# EAGLE design Blumen_Frente (EAGLE 9.6.2)
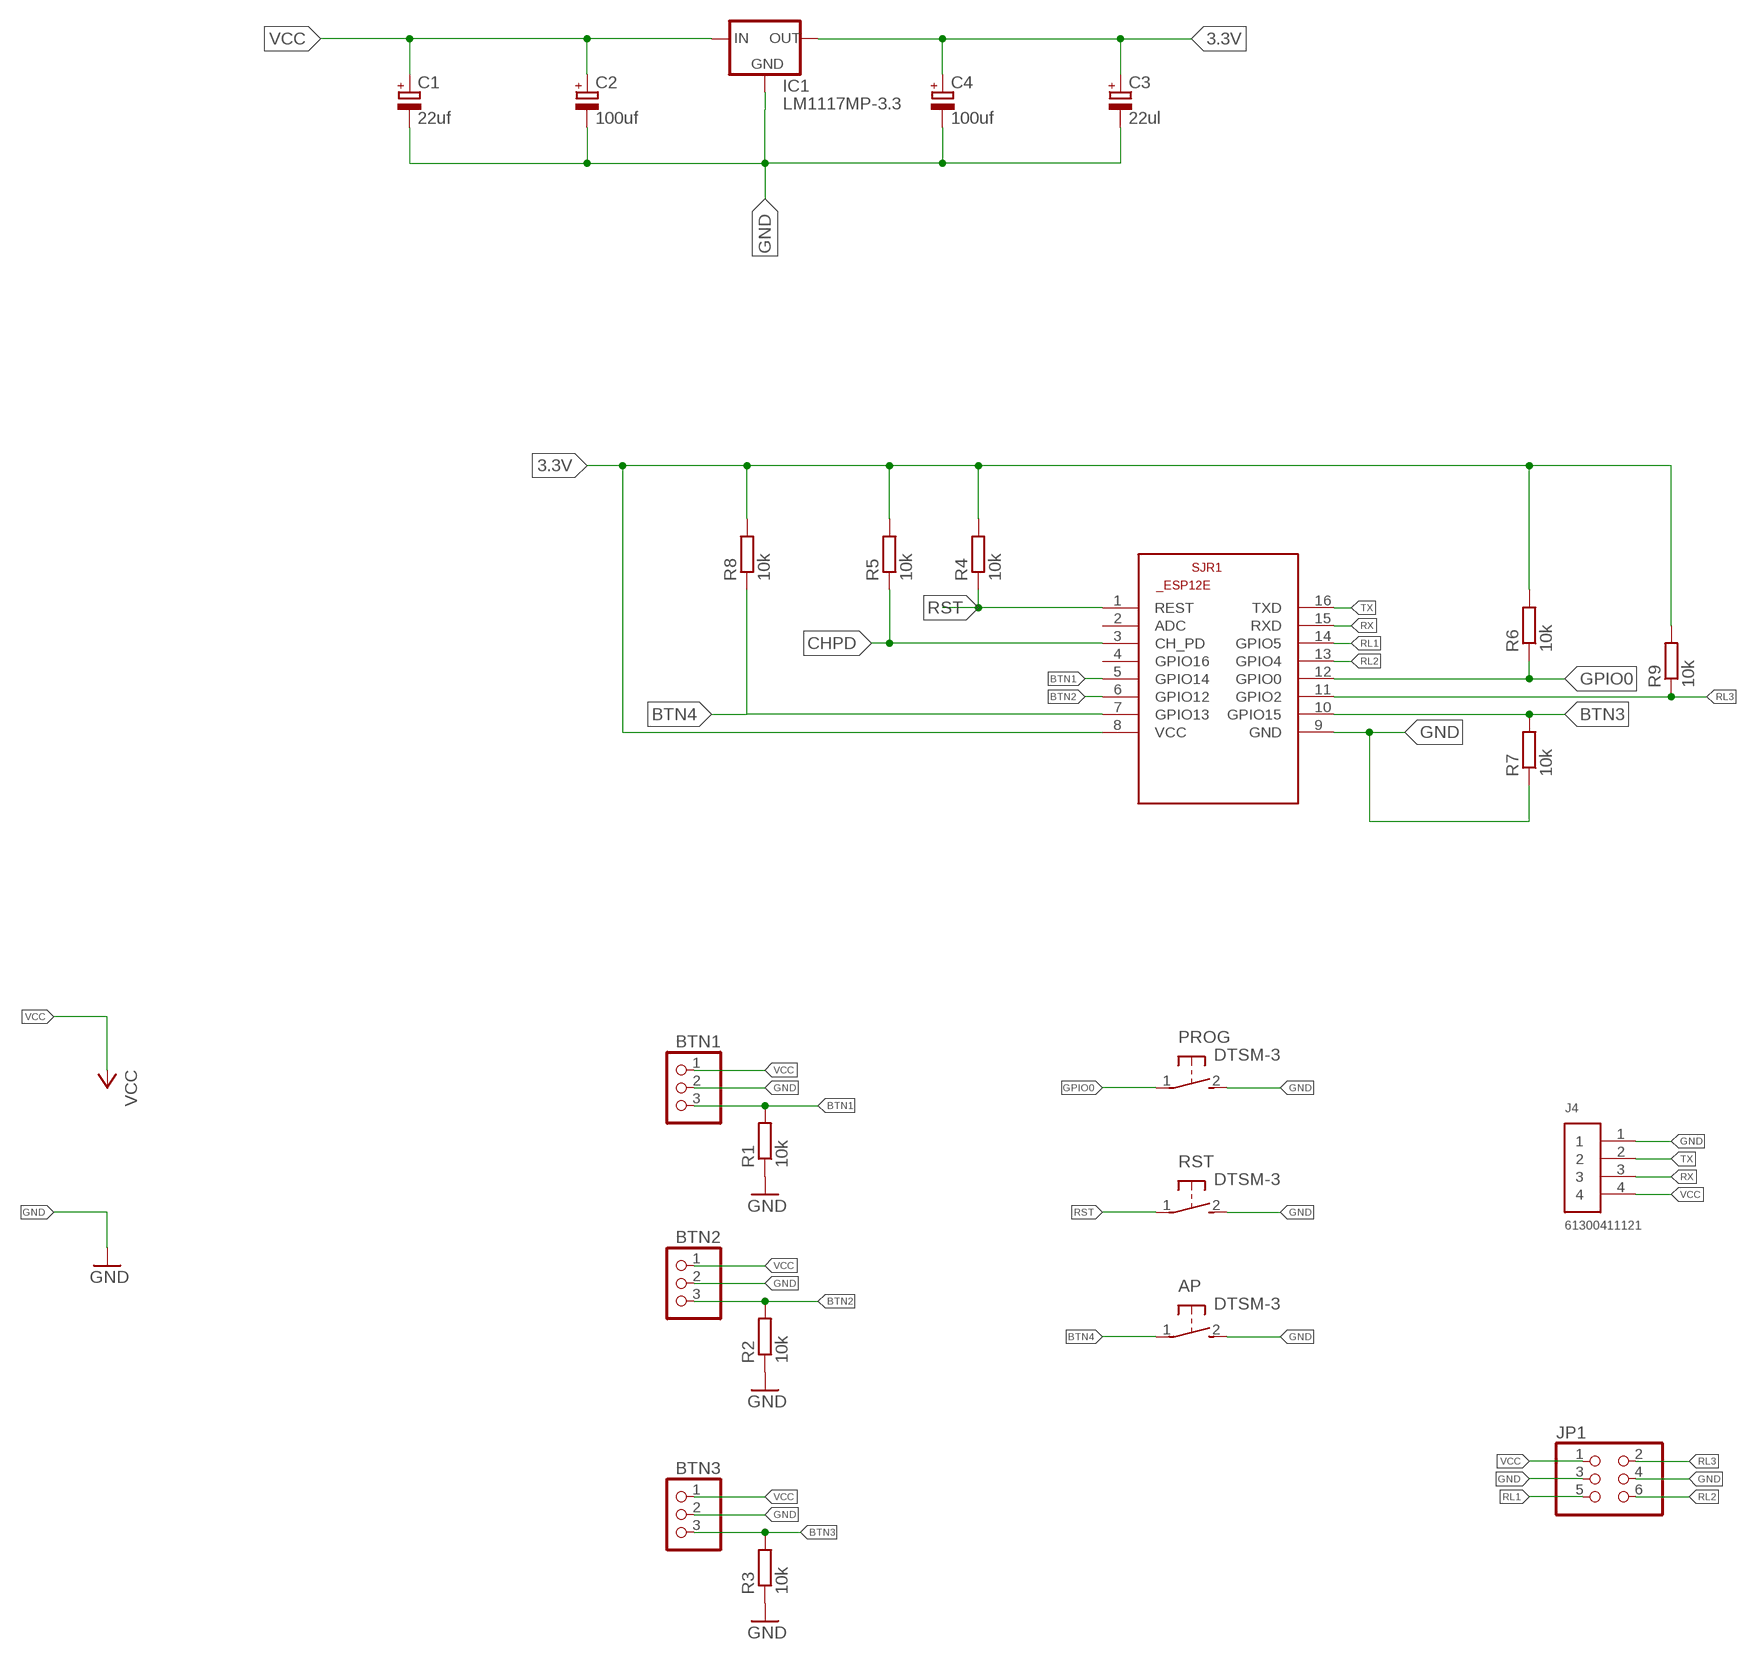
[diagram p0: schematic, sheet 1]

## Parts
AP  DTSM-3  [DTSM-3]
BTN1  PINHD-1X3  [1X03]
BTN2  PINHD-1X3  [1X03]
BTN3  PINHD-1X3  [1X03]
C1  22uf  CPOL-EU153CLV-0505  [153CLV-0505]
C2  100uf  CPOL-EU153CLV-0605  [153CLV-0605]
C3  22ul  CPOL-EU153CLV-0505  [153CLV-0505]
C4  100uf  CPOL-EU153CLV-0605  [153CLV-0605]
IC1  LM1117MP-3.3  [SOT223]
J4  61300411121  [61300411121]
JP1  PINHD-2X3  [2X03]
PROG  DTSM-3  [DTSM-3]
R1  10k  R-EU_R0805  [R0805]
R2  10k  R-EU_R0805  [R0805]
R3  10k  R-EU_R0805  [R0805]
R4  10k  R-EU_R0805  [R0805]
R5  10k  R-EU_R0805  [R0805]
R6  10k  R-EU_R0805  [R0805]
R7  10k  R-EU_R0805  [R0805]
R8  10k  R-EU_R0805  [R0805]
R9  10k  R-EU_R0805  [R0805]
RST  DTSM-3  [DTSM-3]
SJR1  ESP8266-12EESP12E  [ESP8266-ESP12E]

## Nets
3.3V: C3.+ C4.+ IC1.2(OUT) IC1.4(OUT) R4.2 R5.2 R6.2 R8.2 R9.2 SJR1.8(VCC)
BTN1: BTN1.3 R1.2 SJR1.5(GPIO14)
BTN2: BTN2.3 R2.2 SJR1.6(GPIO12)
BTN3: BTN3.3 R3.2 R7.2 SJR1.10(GPIO15)
BTN4: AP.1 R8.1 SJR1.7(GPIO13)
CHPD: R5.1 SJR1.3(CH_PD)
GND: AP.2 BTN1.2 BTN2.2 BTN3.2 C1.- C2.- C3.- C4.- IC1.1(GND) J4.1 JP1.3 JP1.4 PROG.2 R1.1 R2.1 R3.1 R7.1 RST.2 SJR1.9(GND)
GPIO0: PROG.1 R6.1 SJR1.12(GPIO0)
RL1: JP1.5 SJR1.14(GPIO5)
RL2: JP1.6 SJR1.13(GPIO4)
RL3: JP1.2 R9.1 SJR1.11(GPIO2)
RST: R4.1 RST.1 SJR1.1(REST)
RX: J4.3 SJR1.15(RXD)
TX: J4.2 SJR1.16(TXD)
VCC: BTN1.1 BTN2.1 BTN3.1 C1.+ C2.+ IC1.3(IN) J4.4 JP1.1
Unconnected: SJR1.2(ADC) SJR1.4(GPIO16)

## Library data of the parts
AP PROG RST = switch-tact:DTSM-3
BTN1-BTN3 = pinhead:PINHD-1X3: PIN HEADER
C1-C4 = rcl:CPOL-EU: POLARIZED CAPACITOR, European symbol; SPICEPREFIX: C
IC1 = lm1117_10:LM1117?-*: 800mA Low-Dropout Linear Regulator Source: http://www.ti.com/lit/ds/symlink/lm1117-n.pdf; MF: Texas Instruments; MPN: LM1117MP-3.3; OC_FARNELL: 9778195; OC_NEWARK: 28X3416
J4 = Headers:61300411121: CONN HEADER VERT 4POS 2.54MM Manufacturer's datasheet <https://katalog.we-online.de/em/datasheet/6130xx11121.pdf>; CREATED_BY: PCBLayout.com; DIGI_KEY_PART_NUMBER: 732-5317-ND; MANUFACTURER: Wurth Electronics Inc.; MPN: 61300411121
JP1 = pinhead:PINHD-2X3: PIN HEADER
R1-R9 = rcl:R-EU_: RESISTOR, European symbol; SPICEPREFIX: R
SJR1 = esp12e:ESP8266-12E: ESP8266-12E Library for Eagle CAD The author not responsible for any damages or errors!. Created by Suhail jr.lt;/author>

## Net classes
0 default: width 0.152 mm
1 220V: width 1.27 mm

## Board
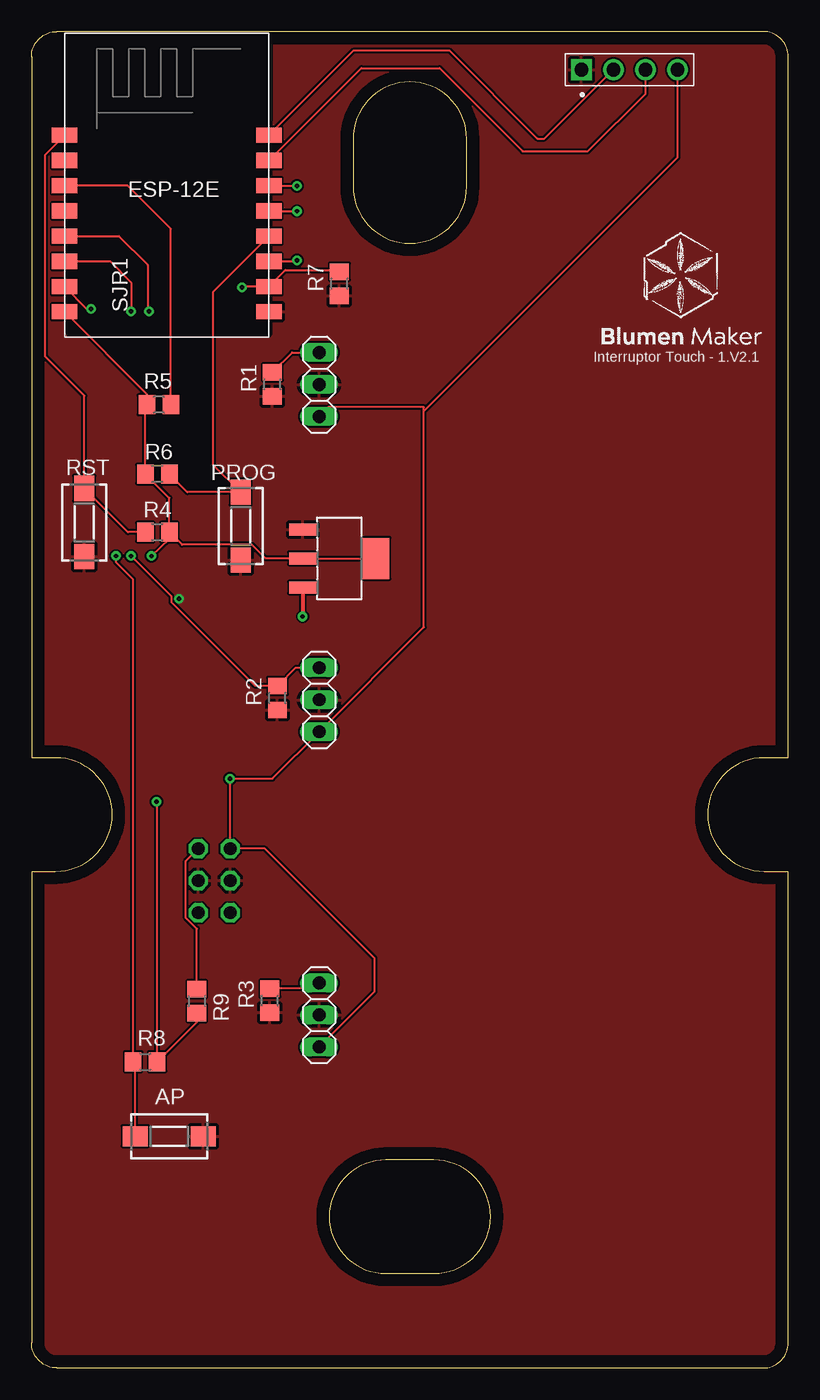
[diagram p1: board, top side]
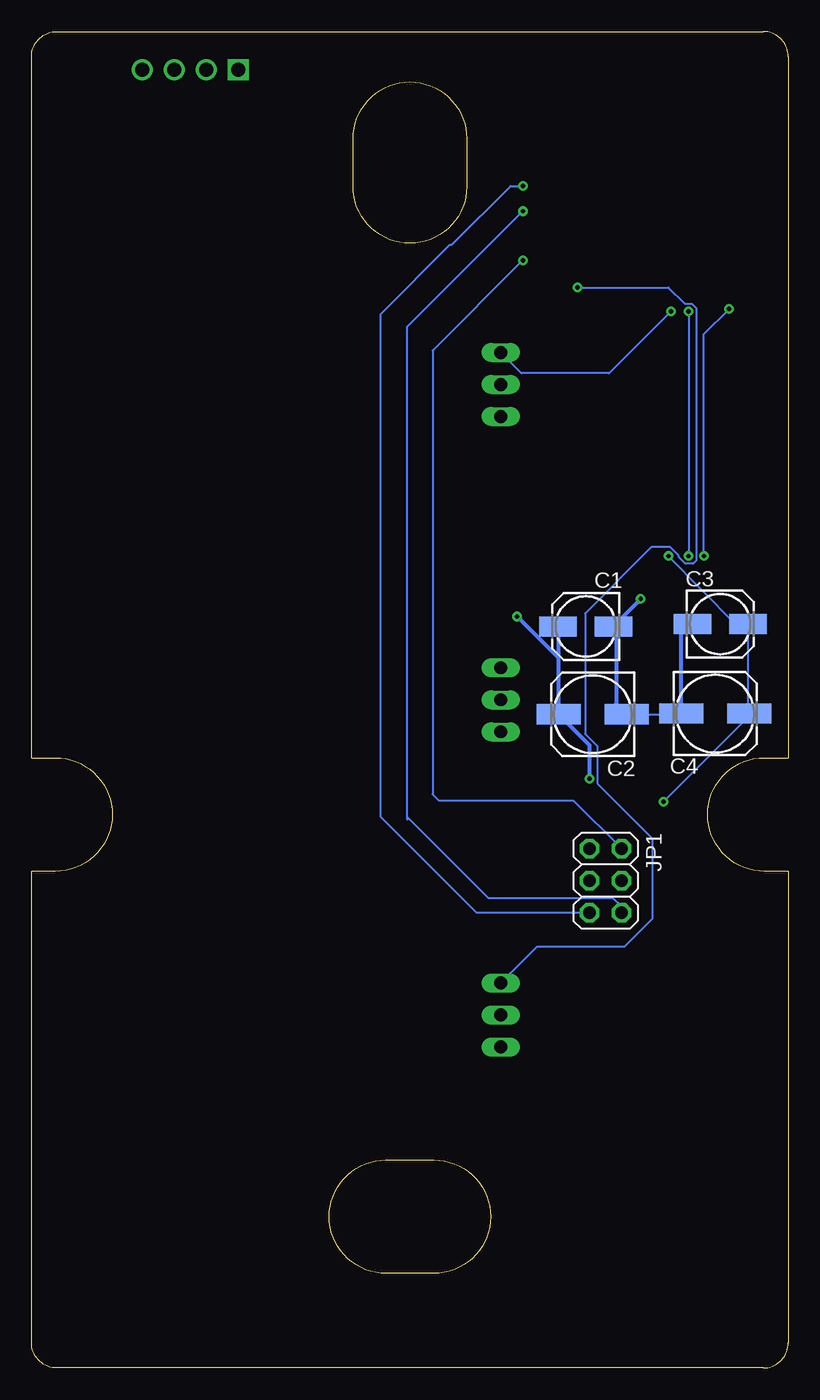
[diagram p2: board, bottom side, seen from below]

Size 60 x 106 mm. Coordinates in mm from the lower left corner, seen from the top.
Outline: 2,0 58,0 arc90 60,2 60,39.4 58.1,39.4 arc-90 53.6,43.9 arc-90 58.1,48.4 60,48.4 60,104 arc90 58,106 2,106 arc90 0,104 0,48.4 1.9,48.4 arc-90 6.4,43.9 arc-90 1.9,39.4 0,39.4 0,2 arc90 2,0
Outline: 23.6,12 arc90 28.1,7.5 31.9,7.5 arc90 36.4,12 arc90 31.9,16.5 28.1,16.5 arc90 23.6,12
Outline: 30,89.2 arc90 34.5,93.7 34.5,97.5 arc90 30,102 arc90 25.5,97.5 25.5,93.7 arc90 30,89.2
Copper layers (1*16): Top 0.035mm / dielectric 1.5mm / Bottom 0.035mm
Design rules "default": minimum track width 6mil, minimum drill 0.35mm, track to track 6mil, track to pad 6mil, pad to pad 6mil, via to via 6mil, smd to smd 6mil, copper to edge 40mil, drill to drill 6mil, minimum pad ring 10mil, minimum via ring 8mil, stop-mask expansion 4mil, vias tented up to drill 0mil, thermal gap 10mil

### Footprints (pad centres in the part's own frame; a part is rotated, then mirrored left to right if it is on the bottom)
DTSM-3 = smd 2 x 1.6: 1 -2.7,0; 2 2.7,0
1X03 = drill 1.016 long: 1 -2.54,0; 2 0,0; 3 2.54,0
153CLV-0505 = smd 3 x 1.6: + 2.2,0; - -2.2,0
153CLV-0605 = smd 3.5 x 1.6: + 2.7,0; - -2.7,0
SOT223 = smd 0.95 x 2.15: 1 -2.3,-2.9; 2 0,-2.9; 3 2.3,-2.9 | smd 3.25 x 2.15: 4 0,2.9
61300411121 = drill 1.1 square: 1 -3.81,0 | drill 1.1: 2 -1.27,0; 3 1.27,0; 4 3.81,0
2X03 = drill 1.016 octagon: 1 -2.54,-1.27; 2 -2.54,1.27; 3 0,-1.27; 4 0,1.27; 5 2.54,-1.27; 6 2.54,1.27
R0805 = smd 1.3 x 1.5: 1 -0.95,0; 2 0.95,0
ESP8266-ESP12E = smd 2 x 1.2: 1 -7.62,5.84; 2 -7.62,3.84; 3 -7.62,1.84; 4 -7.62,-0.16; 5 -7.62,-2.16; 6 -7.62,-4.16; 7 -7.62,-6.16; 8 -7.62,-8.16; 9 8.58,-8.16; 10 8.58,-6.16; 11 8.58,-4.16; 12 8.58,-2.16; 13 8.58,-0.16; 14 8.58,1.84; 15 8.58,3.84; 16 8.58,5.84

### Placement (x,y rotation side)
AP  10.92,18.38 0 top
BTN1  22.8,78 90 top
BTN2  22.8,53 90 top
BTN3  22.8,28 90 top
C1  16.06,58.82 180 bottom
C2  15.51,51.85 180 bottom
C3  5.4,59 0 bottom
C4  5.8,51.9 0 bottom
IC1  24.4,64.2 270 top
J4  47.41,102.97 0 top
JP1  14.49,38.65 270 bottom
PROG  16.58,66.77 270 top
R1  19.1,78.02 90 top
R2  19.5,53.14 90 top
R3  18.9,29.14 90 top
R4  9.98,66.3 0 top
R5  10.1,76.4 180 top
R6  9.98,70.9 180 top
R7  24.41,85.99 90 top
R8  9.01,24.29 0 top
R9  13.1,29.1 270 top
RST  4.18,67.06 270 top
SJR1  10.24,91.93 0 top

### Tracks (layer width: path | path; a pad name or v marks a point on that pad's centre or on a via)
3.3V  (via drill 0.35)
  Top 0.152: R4.2 11.93,65.3 17.47,65.3 18.57,64.2 IC1.2 IC1.4 | R4.2 10.93,69 R6.2 9.03,76.48 9.15,76.6 | R4.2 10.93,65.73 v9.5,64.4 | v9.9,44.9 9.96,44.84 R8.2 13.1,27.43 R9.2 | SJR1.8 9.15,77.24 9.15,76.6 | 9.15,76.6 R5.2
  Bottom 0.152: 3.1,58.9 C3.+ | v9.5,64.4 4.2,59 C3.+ | v9.9,44.9 3.1,51.7 C4.+ 3.2,52 C3.+
BTN1  (via drill 0.35)
  Top 0.152: SJR1.5 6.93,89.77 9.2,87.5 9.2,83.8 v9.3,83.8 | R1.2 20.67,80.54 BTN1.3
  Bottom 0.152: v9.3,83.8 14.2,78.9 21.16,78.9 BTN1.3
BTN2  (via drill 0.35)
  Top 0.152: 22.8,55.44 BTN2.3 20.95,55.54 19.55,54.15 | SJR1.6 6.23,87.77 7.9,86.1 v7.9,83.8 | R2.2 19.55,54.15 | v7.9,64.4 11.09,61.21 11.09,60.75 17.7,54.15 19.55,54.15
  Bottom 0.152: v7.9,83.8 v7.9,64.4
BTN3  (via drill 0.35)
  Top 0.152: SJR1.10 19.02,85.97 | 24.18,87.17 24.27,87.08 | 24.27,87.08 R7.2 | SJR1.10 20.12,87.08 24.27,87.08 | SJR1.10 16.77,85.77 v16.7,85.7 | BTN3.3 22.35,30.09 R3.2
  Bottom 0.152: v16.7,85.7 9.5,85.7 8.21,84.41 7.65,84.41 7.29,84.05 7.29,64.05 7.55,63.79 8.15,63.79 8.69,64.34 8.69,64.45 9.35,65.11 10.85,65.11 16.11,59.85 16.11,50.29 15.14,49.32 15.14,46.34 10.8,42 10.8,35.6 13,33.4 19.94,33.4 BTN3.3 22.42,30.54
BTN4  (via drill 0.35)
  Top 0.152: AP.1 8.22,24.13 R8.1 8.06,62.54 6.69,63.91 v6.69,64.4 | v4.7,84 4.39,84 SJR1.7
  Bottom 0.152: v6.69,64.4 6.69,82.01 v4.7,84
CHPD
  Top 0.152: SJR1.3 7.63,93.77 11.05,90.35 R5.1
GND  (via drill 0.35)
  Top 0.152: 12,61 v11.7,61
  Bottom 0.152: v11.7,61 11.7,60.98 | C4.- 8.55,51.85 C2.- 13.66,52.7 | C1.- 13.66,58.62 | 8.5,58.1 C3.-
  Bottom 0.305: 11.7,60.98 C1.- | 13.66,58.62 13.66,52.7 | C4.- 8.5,58.1
  pour Top: 2.5,105.9 2.5,82.1 2.9,81.7 19,81.7 19.2,81.9 19.2,105.9 60.1,105.9 60.1,-0.2 -0.1,-0.2 -0.1,105.9
GPIO0
  Top 0.152: SJR1.12 14.38,85.33 14.38,71.67 PROG.1 12.36,69.47 R6.1
RL1  (via drill 0.35)
  Top 0.152: SJR1.14 20.97,93.77 21,93.8 v21.05,93.75
  Bottom 0.152: JP1.5 24.71,36.11 32.3,43.7 32.3,83.6 26.82,89.08 26.68,89.08 22.01,93.75 v21.05,93.75
RL2  (via drill 0.35)
  Top 0.152: SJR1.13 20.93,91.77 21,91.7 v21.05,91.75
  Bottom 0.152: v21.05,91.75 30.2,82.6 30.2,43.7 | 30.2,43.5 30.2,43.7 | 30.2,43.7 23.8,37.3 13.9,37.3 13.22,36.62 JP1.6
RL3  (via drill 0.35)
  Top 0.152: SJR1.11 20.87,87.77 21,87.9 v21.05,87.85 | R9.1 13.1,34.83 12.23,35.7 12.23,40.2 JP1.2
  Bottom 0.152: v21.05,87.85 28.2,80.7 28.2,45.5 27.7,45 17.03,45 JP1.2
RST
  Top 0.152: R4.1 7.64,66.3 RST.1 4.18,77.12 1.09,80.21 1.09,96.24 SJR1.1
RX
  Top 0.152: SJR1.15 26.14,103.09 32.35,103.09 38.94,96.5 44.1,96.5 48.68,101.08 J4.3
TX
  Top 0.152: SJR1.16 25.55,104.5 33.1,104.5 40.1,97.5 40.67,97.5 J4.2
VCC  (via drill 0.35)
  Top 0.152: BTN3.1 27.2,29.86 27.2,32.5 18.51,41.19 JP1.1 15.76,46.66 15.8,46.7 v15.75,46.75 19.09,46.75 BTN2.1 | BTN2.1 22.8,49.96 | BTN2.1 31.1,58.76 31.1,75.9 | 31.1,75.9 31.1,76.2 23.54,76.2 BTN1.1 | 31.1,75.9 51.22,96.02 J4.4
  Top 0.305: IC1.3 v21.5,59.6
  Bottom 0.152: 18.21,56.31 C2.+ | 18.21,58.77 C1.+
  Bottom 0.305: v15.75,46.75 15.75,49.39 C2.+ 18.21,58.77 | v21.5,59.6 18.21,56.31

### Text on the board
tNames: Interruptor Touch - 1.V2.1
tValues: GND | TX | RX | VCC